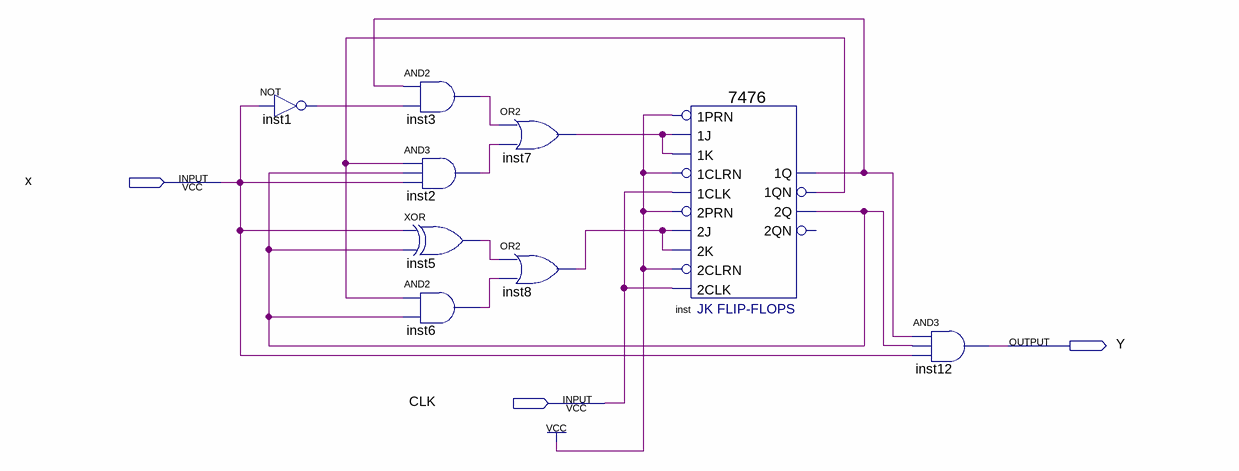
[diagram p0: schematic sheet]
// Quartus schematic testt.bdf as structural Verilog: 9 symbols, 3 pins
module testt (
  input  x,
  input  CLK,
  output Y
);

  wire inst1_out, inst2_out, inst3_out, inst5_out, inst6_out, inst7_out, inst8_out, inst_1q, inst_1qn,
       inst_2q;

  not inst1 (inst1_out, x);
  and inst3 (inst3_out, inst_1q, inst1_out);
  and inst2 (inst2_out, inst_1qn, inst_2q, x);
  xor inst5 (inst5_out, x, inst_2q);
  and inst6 (inst6_out, inst_1qn, inst_2q);
  or inst7 (inst7_out, inst3_out, inst2_out);
  or inst8 (inst8_out, inst5_out, inst6_out);
  \7476  inst (
    .\1J (inst7_out), .\1K (inst7_out), .\1PRN (1'b1), .\2PRN (1'b1), .\2J (inst8_out), .\1CLK (CLK),
    .\1CLRN (1'b1), .\2K (inst8_out), .\2CLRN (1'b1), .\2CLK (CLK), .\1Q (inst_1q), .\2Q (inst_2q),
    .\1QN (inst_1qn));  // open: 2QN
  and inst12 (Y, inst_1q, inst_2q, x);
endmodule
